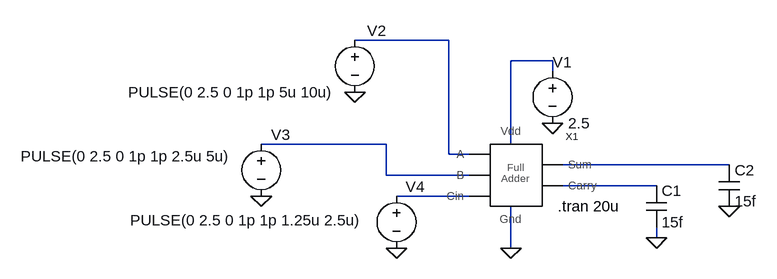
[diagram p0: schematic Assignment.asc]
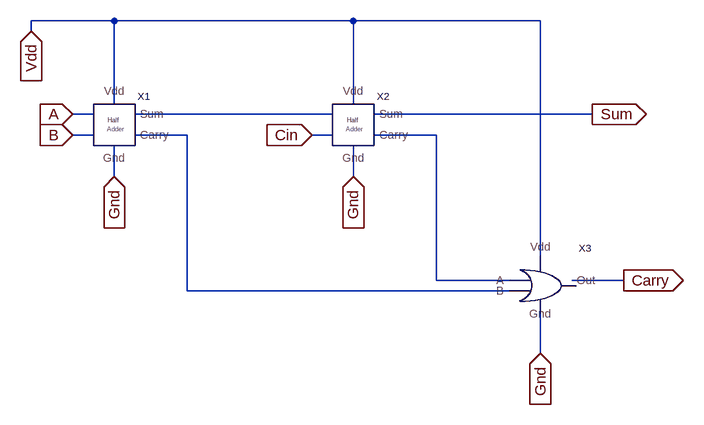
[diagram p1: sub-circuit full_adder.asc]
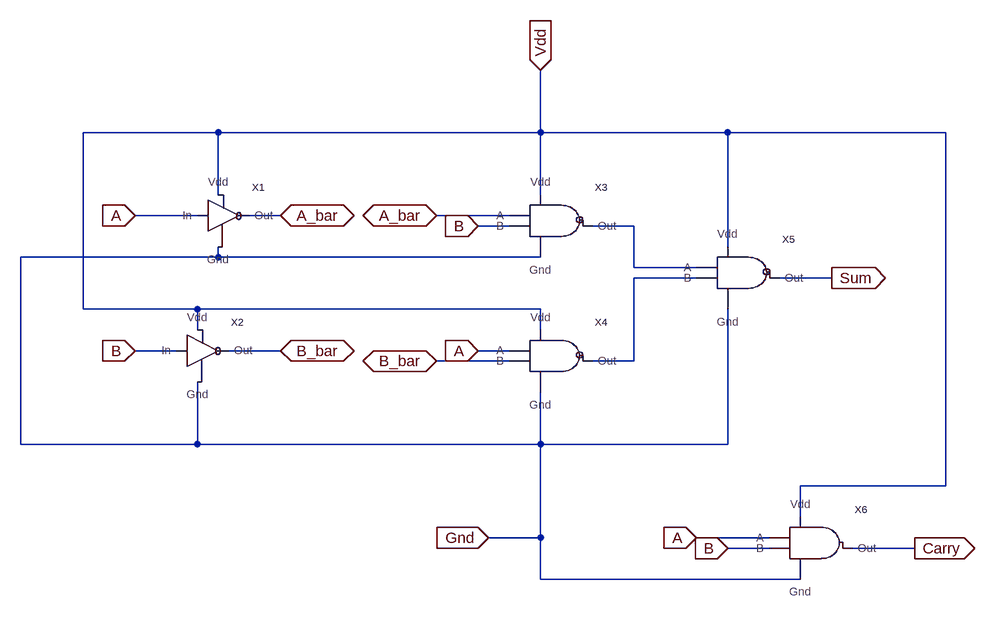
[diagram p2: sub-circuit half_adder.asc]
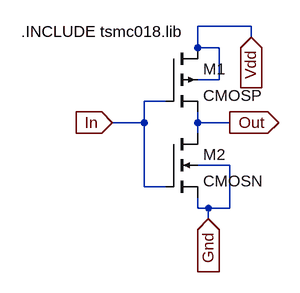
[diagram p3: sub-circuit not.asc]
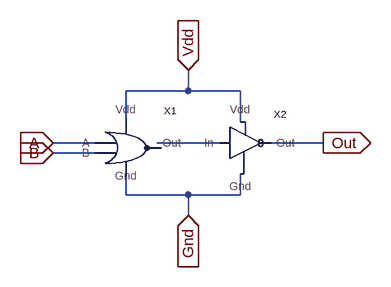
[diagram p4: sub-circuit or.asc]
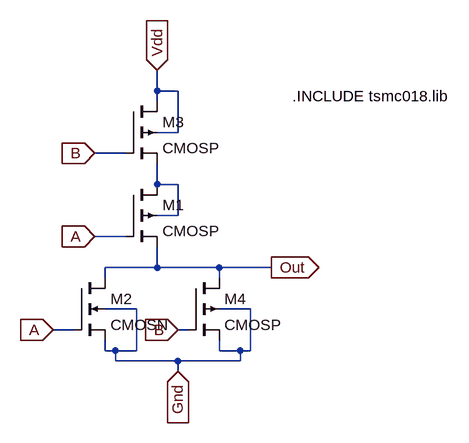
[diagram p5: sub-circuit nor.asc]
Assignment.asc, the LTspice schematic file:
Version 4
SHEET 1 880 680
WIRE 96 -48 -48 -48
WIRE 256 -16 192 -16
WIRE 256 0 256 -16
WIRE 0 112 -192 112
WIRE 192 112 192 -16
WIRE 96 128 96 -48
WIRE 128 128 96 128
WIRE 528 144 272 144
WIRE 0 160 0 112
WIRE 128 160 0 160
WIRE 416 176 272 176
WIRE 128 192 16 192
WIRE 416 256 416 240
WIRE 192 272 192 208
FLAG 256 80 0
FLAG -192 192 0
FLAG 16 272 0
FLAG 192 272 0
FLAG 416 256 0
FLAG 528 208 0
FLAG -48 32 0
SYMBOL Full_Adder 224 160 R0
SYMATTR InstName X1
SYMBOL voltage 256 -16 R0
WINDOW 123 0 0 Left 2
WINDOW 39 0 0 Left 2
WINDOW 0 0 2 Left 2
SYMATTR InstName V1
SYMATTR Value 2.5
SYMBOL voltage -48 -64 R0
WINDOW 3 -349 96 Left 2
WINDOW 123 0 0 Left 2
WINDOW 39 0 0 Left 2
WINDOW 0 19 2 Left 2
SYMATTR Value PULSE(0 2.5 0 1p 1p 5u 10u)
SYMATTR InstName V2
SYMBOL voltage -192 96 R0
WINDOW 3 -370 35 Left 2
WINDOW 123 0 0 Left 2
WINDOW 39 0 0 Left 2
WINDOW 0 15 2 Left 2
SYMATTR Value PULSE(0 2.5 0 1p 1p 2.5u 5u)
SYMATTR InstName V3
SYMBOL voltage 16 176 R0
WINDOW 3 -410 53 Left 2
WINDOW 123 0 0 Left 2
WINDOW 39 0 0 Left 2
WINDOW 0 14 2 Left 2
SYMATTR Value PULSE(0 2.5 0 1p 1p 1.25u 2.5u)
SYMATTR InstName V4
SYMBOL cap 400 176 R0
SYMATTR InstName C1
SYMATTR Value 15f
SYMBOL cap 512 144 R0
SYMATTR InstName C2
SYMATTR Value 15f
TEXT 264 208 Left 2 !.tran 20u

full_adder.asc, the sub-circuit schematic file:
Version 4
SHEET 1 1020 680
WIRE 112 0 -16 0
WIRE 480 0 112 0
WIRE 768 0 480 0
WIRE -16 16 -16 0
WIRE 112 128 112 0
WIRE 480 128 480 0
WIRE 80 144 48 144
WIRE 448 144 144 144
WIRE 848 144 512 144
WIRE 80 176 48 176
WIRE 224 176 144 176
WIRE 448 176 416 176
WIRE 608 176 512 176
WIRE 112 240 112 192
WIRE 480 240 480 192
WIRE 768 368 768 0
WIRE 608 400 608 176
WIRE 720 400 608 400
WIRE 896 400 816 400
WIRE 224 416 224 176
WIRE 720 416 224 416
WIRE 768 512 768 432
FLAG 48 144 A
IOPIN 48 144 In
FLAG 48 176 B
IOPIN 48 176 In
FLAG 416 176 Cin
IOPIN 416 176 In
FLAG -16 16 Vdd
IOPIN -16 16 In
FLAG 112 240 Gnd
IOPIN 112 240 In
FLAG 480 240 Gnd
IOPIN 480 240 In
FLAG 768 512 Gnd
IOPIN 768 512 In
FLAG 848 144 Sum
IOPIN 848 144 Out
FLAG 896 400 Carry
IOPIN 896 400 Out
SYMBOL Half_Adder 144 176 R0
SYMATTR InstName X1
SYMBOL Half_Adder 512 176 R0
SYMATTR InstName X2
SYMBOL OR 768 432 R0
SYMATTR InstName X3

half_adder.asc, the sub-circuit schematic file:
Version 4
SHEET 1 1124 744
WIRE -112 0 -320 0
WIRE 384 0 384 -96
WIRE 384 0 -112 0
WIRE 672 0 384 0
WIRE 1008 0 672 0
WIRE -112 96 -112 0
WIRE 384 96 384 0
WIRE -144 128 -240 128
WIRE -16 128 -64 128
WIRE 336 128 224 128
WIRE 336 144 288 144
WIRE 528 144 464 144
WIRE 672 176 672 0
WIRE -112 192 -112 176
WIRE -112 192 -416 192
WIRE 384 192 -112 192
WIRE 528 208 528 144
WIRE 624 208 528 208
WIRE 624 224 528 224
WIRE 832 224 752 224
WIRE -320 272 -320 0
WIRE -144 272 -320 272
WIRE 384 272 -144 272
WIRE -144 304 -144 272
WIRE 384 304 384 272
WIRE -176 336 -240 336
WIRE -16 336 -96 336
WIRE 336 336 288 336
WIRE 336 352 224 352
WIRE 528 352 528 224
WIRE 528 352 464 352
WIRE -416 480 -416 192
WIRE -144 480 -144 384
WIRE -144 480 -416 480
WIRE 384 480 384 400
WIRE 384 480 -144 480
WIRE 672 480 672 272
WIRE 672 480 384 480
WIRE 1008 544 1008 0
WIRE 1008 544 784 544
WIRE 784 592 784 544
WIRE 384 624 384 480
WIRE 384 624 304 624
WIRE 736 624 624 624
WIRE 736 640 672 640
WIRE 960 640 864 640
WIRE 384 688 384 624
WIRE 784 688 384 688
FLAG 384 -96 Vdd
IOPIN 384 -96 In
FLAG 304 624 Gnd
IOPIN 304 624 In
FLAG -240 128 A
IOPIN -240 128 In
FLAG -240 336 B
IOPIN -240 336 In
FLAG 288 144 B
IOPIN 288 144 In
FLAG 288 336 A
IOPIN 288 336 In
FLAG 624 624 A
IOPIN 624 624 In
FLAG 672 640 B
IOPIN 672 640 In
FLAG 832 224 Sum
IOPIN 832 224 Out
FLAG 960 640 Carry
IOPIN 960 640 Out
FLAG -16 128 A_bar
IOPIN -16 128 BiDir
FLAG 224 128 A_bar
IOPIN 224 128 BiDir
FLAG -16 336 B_bar
IOPIN -16 336 BiDir
FLAG 224 352 B_bar
IOPIN 224 352 BiDir
SYMBOL NAND 416 176 R0
SYMATTR InstName X3
SYMBOL NAND 416 384 R0
SYMATTR InstName X4
SYMBOL NAND 704 256 R0
SYMATTR InstName X5
SYMBOL AND 816 672 R0
SYMATTR InstName X6
SYMBOL NOT -80 160 R0
SYMATTR InstName X1
SYMBOL NOT -112 368 R0
SYMATTR InstName X2

not.asc, the sub-circuit schematic file:
Version 4
SHEET 1 880 680
WIRE 224 32 144 32
WIRE 224 48 224 32
WIRE 144 64 144 32
WIRE 176 64 144 64
WIRE 176 112 176 64
WIRE 176 112 144 112
WIRE 96 144 64 144
WIRE 64 176 64 144
WIRE 64 176 16 176
WIRE 144 176 144 160
WIRE 192 176 144 176
WIRE 144 192 144 176
WIRE 192 240 144 240
WIRE 64 272 64 176
WIRE 96 272 64 272
WIRE 144 304 144 288
WIRE 160 304 144 304
WIRE 192 304 192 240
WIRE 192 304 160 304
WIRE 160 320 160 304
FLAG 160 320 Gnd
IOPIN 160 320 In
FLAG 192 176 Out
IOPIN 192 176 Out
FLAG 224 48 Vdd
IOPIN 224 48 In
FLAG 16 176 In
IOPIN 16 176 In
SYMBOL cmosp 96 64 R0
SYMATTR InstName M1
SYMATTR Value2 l=180n w=800n
SYMBOL cmosn 96 192 R0
SYMATTR InstName M2
SYMATTR Value2 l=180n w=400n
TEXT -120 40 Left 2 !.INCLUDE tsmc018.lib

or.asc, the sub-circuit schematic file:
Version 4
SHEET 1 880 680
WIRE 176 80 176 48
WIRE 176 80 80 80
WIRE 256 80 176 80
WIRE 80 128 80 80
WIRE 256 128 256 80
WIRE 32 160 -32 160
WIRE 224 160 128 160
WIRE 384 160 304 160
WIRE 32 176 -32 176
WIRE 80 240 80 192
WIRE 176 240 80 240
WIRE 256 240 256 208
WIRE 256 240 176 240
WIRE 176 272 176 240
FLAG -32 160 A
IOPIN -32 160 In
FLAG -32 176 B
IOPIN -32 176 In
FLAG 176 272 Gnd
IOPIN 176 272 In
FLAG 176 48 Vdd
IOPIN 176 48 In
FLAG 384 160 Out
IOPIN 384 160 Out
SYMBOL NOR 80 192 R0
SYMATTR InstName X1
SYMBOL NOT 288 192 R0
SYMATTR InstName X2

nor.asc, the sub-circuit schematic file:
Version 4
SHEET 1 880 680
WIRE 144 -80 144 -112
WIRE 176 -80 144 -80
WIRE 144 -64 144 -80
WIRE 176 -16 176 -80
WIRE 176 -16 144 -16
WIRE 96 16 48 16
WIRE 144 64 144 32
WIRE 176 64 144 64
WIRE 176 112 176 64
WIRE 176 112 144 112
WIRE 96 144 48 144
WIRE 144 192 144 160
WIRE 144 192 64 192
WIRE 240 192 144 192
WIRE 320 192 240 192
WIRE 64 208 64 192
WIRE 240 208 240 192
WIRE 112 256 64 256
WIRE 288 256 240 256
WIRE 16 288 -16 288
WIRE 192 288 176 288
WIRE 64 320 64 304
WIRE 80 320 64 320
WIRE 112 320 112 256
WIRE 112 320 80 320
WIRE 240 320 240 304
WIRE 272 320 240 320
WIRE 288 320 288 256
WIRE 288 320 272 320
WIRE 80 336 80 320
WIRE 176 336 80 336
WIRE 272 336 272 320
WIRE 272 336 176 336
WIRE 176 352 176 336
FLAG 176 352 Gnd
IOPIN 176 352 In
FLAG -16 288 A
IOPIN -16 288 In
FLAG 48 144 A
IOPIN 48 144 In
FLAG 176 288 B
IOPIN 176 288 In
FLAG 48 16 B
IOPIN 48 16 In
FLAG 320 192 Out
IOPIN 320 192 Out
FLAG 144 -112 Vdd
IOPIN 144 -112 In
SYMBOL cmosp 96 64 R0
SYMATTR InstName M1
SYMATTR Value2 l=180n w=1600n
SYMBOL cmosn 16 208 R0
SYMATTR InstName M2
SYMATTR Value2 l=180n w=400n
SYMBOL cmosp 96 -64 R0
SYMATTR InstName M3
SYMATTR Value2 l=180n w=1600n
SYMBOL cmosp 192 208 R0
SYMATTR InstName M4
SYMATTR Value2 l=180n w=400n
TEXT 352 -72 Left 2 !.INCLUDE tsmc018.lib

The netlist it stands for:
* Assignment.asc
XX1 N001 N003 N006 N004 N005 N002 0 full_adder
V1 N002 0 2.5
V2 N001 0 PULSE(0 2.5 0 1p 1p 5u 10u)
V3 N003 0 PULSE(0 2.5 0 1p 1p 2.5u 5u)
V4 N006 0 PULSE(0 2.5 0 1p 1p 1.25u 2.5u)
C1 N005 0 15f
C2 N004 0 15f

* block symbol definitions
.subckt full_adder A B Cin Sum Carry Vdd Gnd
XX1 Vdd Gnd N001 N002 A B half_adder
XX2 Vdd Gnd Sum N003 N001 Cin half_adder
XX3 N003 N002 Vdd Gnd Carry or
.ends full_adder

.subckt half_adder Vdd Gnd Sum Carry A B
XX3 A_bar B Vdd N001 Gnd NAND  ; pins A B Vdd Out Gnd
XX4 A B_bar Vdd N002 Gnd NAND  ; pins A B Vdd Out Gnd
XX5 N001 N002 Vdd Sum Gnd NAND  ; pins A B Vdd Out Gnd
XX6 A B Vdd Carry Gnd AND  ; pins A B Vdd Out Gnd
XX1 A A_bar Vdd Gnd not
XX2 B B_bar Vdd Gnd not
.ends half_adder

.subckt not In Out Vdd Gnd
M1 Vdd In Out Vdd CMOSP l=180n w=800n
M2 Out In Gnd Gnd CMOSN l=180n w=400n
.INCLUDE tsmc018.lib
.ends not

.subckt or A B Vdd Gnd Out
XX1 A B Vdd Gnd N001 nor
XX2 N001 Out Vdd Gnd not
.ends or

.subckt nor A B Vdd Gnd Out
M1 N001 A Out N001 CMOSP l=180n w=1600n
M2 Out A Gnd Gnd CMOSN l=180n w=400n
M3 Vdd B N001 Vdd CMOSP l=180n w=1600n
M4 Out B Gnd Gnd CMOSP l=180n w=400n
.INCLUDE tsmc018.lib
.ends nor

.model NMOS NMOS
.model PMOS PMOS
.lib standard.mos
.tran 20u
.backanno
.end